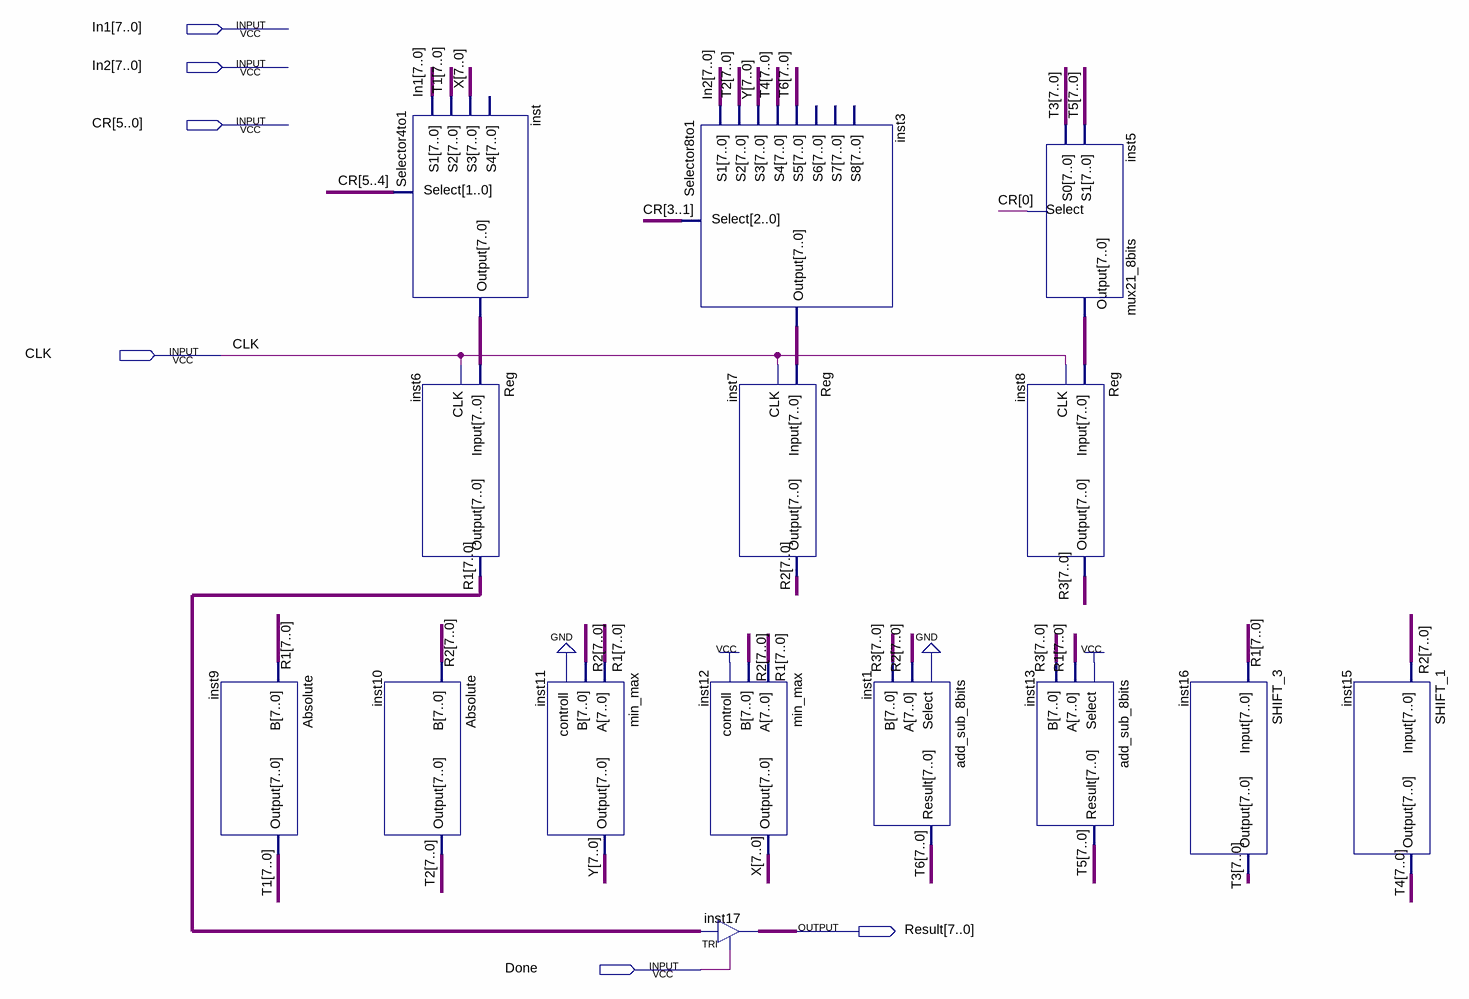
[diagram p0: schematic sheet]
// Quartus schematic Datapath_version1.bdf as structural Verilog: 15 symbols, 6 pins
module Datapath_version1 (
  input  [7:0] In1,
  input  [7:0] In2,
  input  [5:0] CR,
  input  CLK,
  input  Done,
  output [7:0] Result
);

  wire [7:0] inst3_output, inst5_output, inst_output, R1, R2, R3, T1, T2, T3, T4, T5, T6, X, Y;

  Absolute inst9 (.B(R1), .Output(T1));
  Absolute inst10 (.B(R2), .Output(T2));
  Selector4to1 inst (.S1(In1), .S2(T1), .S3(X), .Select(CR[5:4]), .Output(inst_output));  // open: S4
  Reg inst6 (.Input(inst_output), .CLK(CLK), .Output(R1));
  min_max inst11 (.A(R1), .B(R2), .controll(1'b0), .Output(Y));
  Selector8to1 inst3 (
    .S1(In2), .S2(T2), .S3(Y), .S4(T4), .S5(T6), .Select(CR[3:1]), .Output(inst3_output));  // open: S6, S7, S8
  min_max inst12 (.A(R1), .B(R2), .controll(1'b1), .Output(X));
  Reg inst7 (.Input(inst3_output), .CLK(CLK), .Output(R2));
  TRI inst17[7:0] (.IN(R1), .OE(Done), .OUT(Result));
  add_sub_8bits inst1 (.Select(1'b0), .A(R2), .B(R3), .Result(T6));
  mux21_8bits inst5 (.S0(T3), .S1(T5), .Select(CR[0]), .Output(inst5_output));
  Reg inst8 (.Input(inst5_output), .CLK(CLK), .Output(R3));
  add_sub_8bits inst13 (.Select(1'b1), .A(R1), .B(R3), .Result(T5));
  SHIFT_3 inst16 (.Input(R1), .Output(T3));
  SHIFT_1 inst15 (.Input(R2), .Output(T4));
endmodule
